# EAGLE design ard-card-adapter (EAGLE 9.3.1)
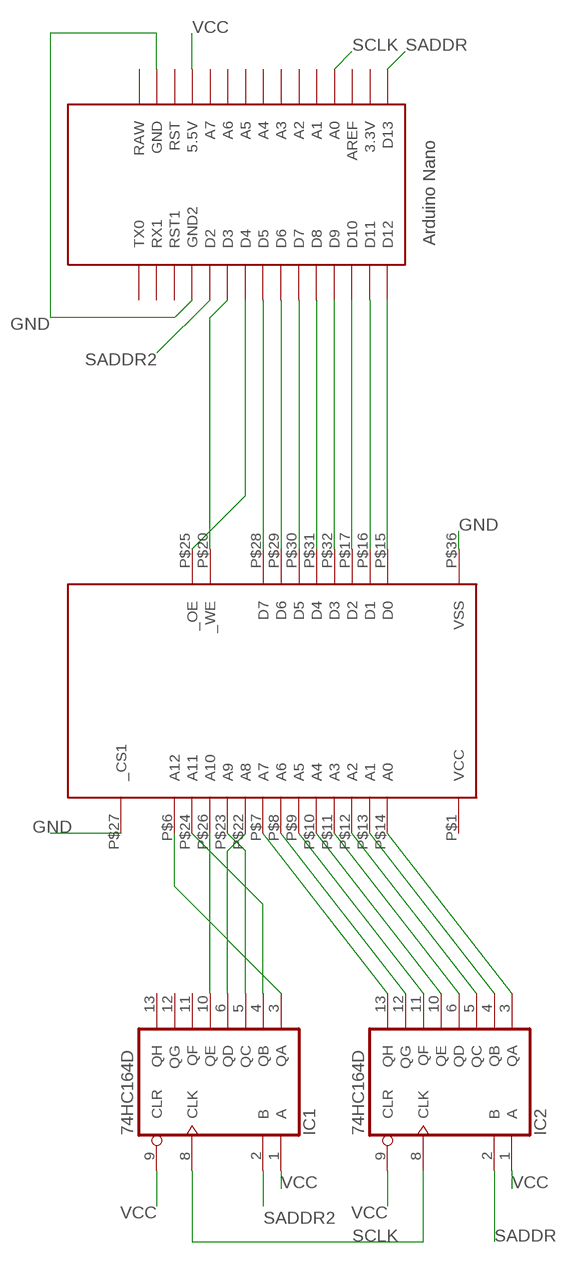
[diagram p0: schematic, sheet 1]

## Parts
IC1  74HC164D  [SO14]
IC2  74HC164D  [SO14]
U$1  NANO  [NANO]
U$2  28C64SLOT  [SLOT36]

## Nets
GND: U$1.GND U$1.GND1(GND2) U$2.P$27(_CS1) U$2.P$36(VSS)
N$1: U$1.D12 U$2.P$15(D0)
N$2: U$1.D11 U$2.P$16(D1)
N$3: U$1.D10 U$2.P$17(D2)
N$4: U$1.D9 U$2.P$32(D3)
N$5: U$1.D8 U$2.P$31(D4)
N$6: U$1.D7 U$2.P$30(D5)
N$7: U$1.D6 U$2.P$29(D6)
N$8: U$1.D5 U$2.P$28(D7)
N$9: U$1.D4 U$2.P$25(_OE)
N$10: U$1.D3 U$2.P$20(_WE)
N$11: IC2.13(QH) U$2.P$7(A7)
N$12: IC2.3(QA) U$2.P$14(A0)
N$13: IC2.4(QB) U$2.P$13(A1)
N$14: IC2.5(QC) U$2.P$12(A2)
N$15: IC2.6(QD) U$2.P$11(A3)
N$16: IC2.10(QE) U$2.P$10(A4)
N$17: IC2.11(QF) U$2.P$9(A5)
N$18: IC2.12(QG) U$2.P$8(A6)
N$19: IC1.3(QA) U$2.P$6(A12)
N$20: IC1.4(QB) U$2.P$24(A11)
N$21: IC1.5(QC) U$2.P$23(A9)
N$22: IC1.6(QD) U$2.P$22(A8)
N$23: IC1.10(QE) U$2.P$26(A10)
SADDR: IC2.2(B) U$1.D13
SADDR2: IC1.2(B) U$1.D2
SCLK: IC1.8(CLK) IC2.8(CLK) U$1.A0
VCC: IC1.1(A) IC1.9(CLR) IC2.1(A) IC2.9(CLR) U$1.5V(5.5V)
Unconnected: IC1.11(QF) IC1.12(QG) IC1.13(QH) U$1.3.3V U$1.A1 U$1.A2 U$1.A3 U$1.A4 U$1.A5 U$1.A6 U$1.A7 U$1.AREF U$1.ICSP1 U$1.ICSP2 U$1.ICSP3 U$1.ICSP4 U$1.ICSP5 U$1.ICSP6 U$1.RAW U$1.RST U$1.RST1 U$1.RX1 U$1.TX0

## Power pins joined to a net without a drawn wire
GND: IC1.7(GND) IC2.7(GND)
VCC: IC1.14(VCC) IC2.14(VCC) U$2.P$1(VCC)

## Library data of the parts
IC1 IC2 = 74xx-us:74*164: 8-bit parallel out SHIFT REGISTER
U$1 = Arduino-clone:NANO: Arduino Nano
U$2 = mychips:28C64

## Board
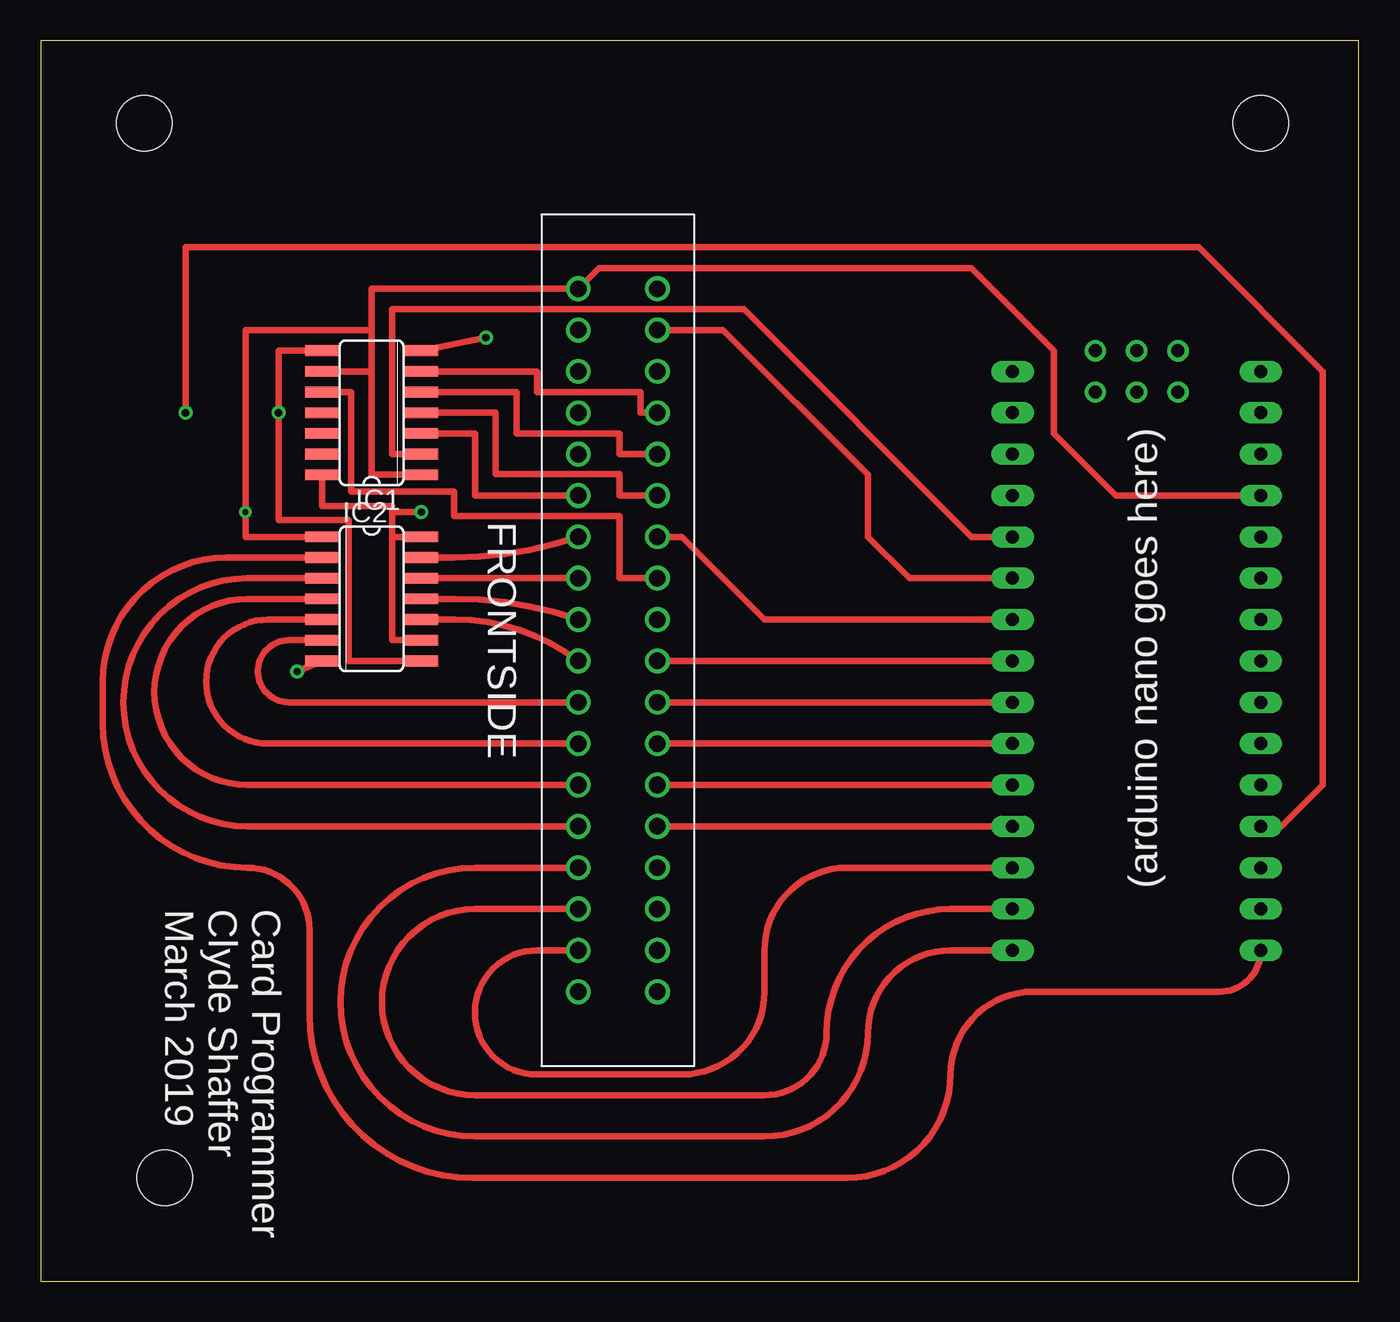
[diagram p1: board, top side]
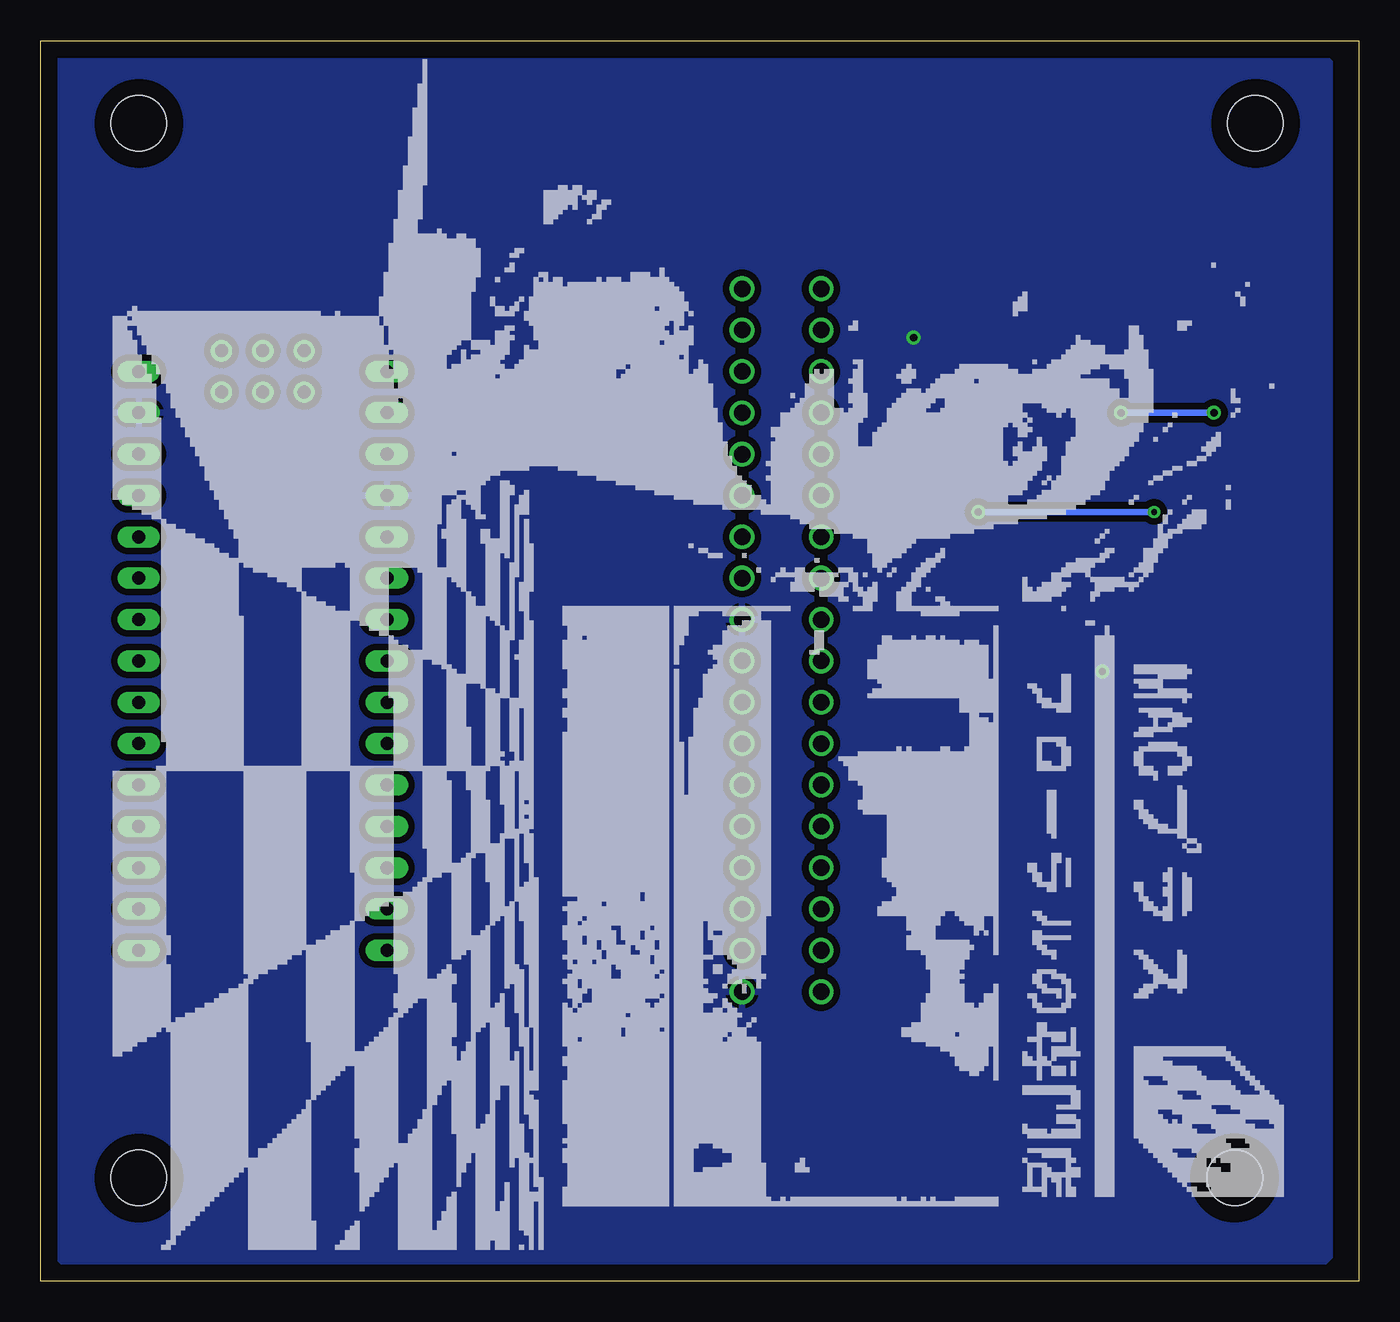
[diagram p2: board, bottom side, seen from below]

Size 80.95 x 76.19 mm. Coordinates in mm from the lower left corner, seen from the top.
Outline: 0,0 80.95,0 80.95,76.19 0,76.19 0,0
Copper layers (1*16): Top 0.035mm / dielectric 1.5mm / Bottom 0.035mm
Design rules "default": minimum track width 6mil, minimum drill 0.35mm, track to track 6mil, track to pad 6mil, pad to pad 6mil, via to via 6mil, smd to smd 6mil, copper to edge 40mil, drill to drill 6mil, minimum pad ring 10mil, minimum via ring 8mil, stop-mask expansion 4mil, vias tented up to drill 0mil, thermal gap 10mil
Holes 3.4 mm at 6.35,71.12 74.93,71.12 74.93,6.35 7.62,6.35

### Footprints (pad centres in the part's own frame; a part is rotated, then mirrored left to right if it is on the bottom)
SO14 = smd 0.66 x 2.032: 1 -3.81,-3.073; 2 -2.54,-3.073; 3 -1.27,-3.073; 4 0,-3.073; 5 1.27,-3.073; 6 2.54,-3.073; 7 3.81,-3.073; 8 3.81,3.073; 9 2.54,3.073; 10 1.27,3.073; 11 0,3.073; 12 -1.27,3.073; 13 -2.54,3.073; 14 -3.81,3.073
NANO = drill 0.8 long: 3.3V -10.16,24.13; 5V -10.16,-1.27; A0 -10.16,19.05; A1 -10.16,16.51; A2 -10.16,13.97; A3 -10.16,11.43; A4 -10.16,8.89; A5 -10.16,6.35; A6 -10.16,3.81; A7 -10.16,1.27; AREF -10.16,21.59; D2 5.08,1.27; D3 5.08,3.81; D4 5.08,6.35; D5 5.08,8.89; D6 5.08,11.43; D7 5.08,13.97; D8 5.08,16.51; D9 5.08,19.05; D10 5.08,21.59; D11 5.08,24.13; D12 5.08,26.67; D13 -10.16,26.67; GND -10.16,-6.35; GND1 5.08,-1.27; RAW -10.16,-8.89; RST -10.16,-3.81; RST1 5.08,-3.81; RX1 5.08,-6.35; TX0 5.08,-8.89 | drill 0.8: ICSP1 -5.08,-10.16; ICSP2 -5.08,-7.62; ICSP3 -2.54,-10.16; ICSP4 -2.54,-7.62; ICSP5 0,-10.16; ICSP6 0,-7.62
SLOT36 = drill 1.016 pad 1.524: P$1 -21.59,0; P$2 -19.05,0; P$3 -16.51,0; P$4 -13.97,0; P$5 -11.43,0; P$6 -8.89,0; P$7 -6.35,0; P$8 -3.81,0; P$9 -1.27,0; P$10 1.27,0; P$11 3.81,0; P$12 6.35,0; P$13 8.89,0; P$14 11.43,0; P$15 13.97,0; P$16 16.51,0; P$17 19.05,0; P$18 21.59,0; P$19 -21.59,4.851; P$20 -19.05,4.851; P$21 -16.51,4.851; P$22 -13.97,4.851; P$23 -11.43,4.851; P$24 -8.89,4.851; P$25 -6.35,4.851; P$26 -3.81,4.851; P$27 -1.27,4.851; P$28 1.27,4.851; P$29 3.81,4.851; P$30 6.35,4.851; P$31 8.89,4.851; P$32 11.43,4.851; P$33 13.97,4.851; P$34 16.51,4.851; P$35 19.05,4.851; P$36 21.59,4.851

### Placement (x,y rotation side)
IC1  20.32,53.34 90 top
IC2  20.32,41.91 270 top
U$1  64.77,46.99 180 top
U$2  33.02,39.37 270 top

### Tracks (layer width: path | path; a pad name or v marks a point on that pad's centre or on a via)
GND  (via drill 0.45)
  Top 0.406: IC1.7 v27.34,57.95 | IC2.7 v15.75,37.45
  pour Bottom (isolate 0.406): 1.78,74 1.78,1.51 2.1,1.19 79.62,1.19 79.94,1.51 79.94,71.62 79.94,74.87 79.62,75.19 2.97,75.19 2.1,75.19 1.78,74.87
N$1
  Top 0.406: U$2.P$15 26.67,25.4 arc180 26.67,8.89 44.45,8.89 arc90 50.8,15.24 arc-90 55.88,20.32 U$1.D12
N$2
  Top 0.406: U$2.P$16 26.67,22.86 arc180 26.67,11.43 44.45,11.43 arc90 48.26,15.24 arc-90 55.88,22.86 U$1.D11
N$3
  Top 0.406: U$2.P$17 30.48,20.32 arc180 30.48,12.7 39.37,12.7 arc90 44.45,17.78 44.45,20.32 arc-90 49.53,25.4 U$1.D10
N$4
  Top 0.406: U$2.P$32 U$1.D9
N$5
  Top 0.406: U$2.P$31 U$1.D8
N$6
  Top 0.406: U$2.P$30 U$1.D7
N$7
  Top 0.406: U$2.P$29 U$1.D6
N$8
  Top 0.406: U$2.P$28 U$1.D5
N$9
  Top 0.406: U$2.P$25 39.37,45.72 44.45,40.64 U$1.D4
N$10
  Top 0.406: U$2.P$20 41.91,58.42 50.8,49.53 50.8,45.72 53.34,43.18 U$1.D3
N$11
  Top 0.406: IC2.13 25.4,44.45 arc19 U$2.P$7
N$12
  Top 0.406: IC2.3 12.7,43.18 arc180 12.7,27.94 U$2.P$14
N$13
  Top 0.406: IC2.4 12.7,41.91 arc180 12.7,30.48 U$2.P$13
N$14
  Top 0.406: IC2.5 13.97,40.64 arc180 13.97,33.02 U$2.P$12
N$15
  Top 0.406: IC2.6 15.24,39.37 arc180 15.24,35.56 U$2.P$11
N$16
  Top 0.406: IC2.10 25.4,40.64 arc-37 U$2.P$10
N$17
  Top 0.406: IC2.11 25.4,41.91 arc-19 U$2.P$9
N$18
  Top 0.406: IC2.12 U$2.P$8
N$19
  Top 0.406: IC1.3 26.67,52.07 26.67,48.26 U$2.P$6
N$20
  Top 0.406: U$2.P$24 35.56,48.26 35.56,49.58 27.94,49.58 27.94,53.34 IC1.4
N$21
  Top 0.406: IC1.5 29.21,54.61 29.21,52.07 35.56,52.07 35.56,50.8 U$2.P$23
N$22
  Top 0.406: IC1.6 30.48,55.88 30.48,54.61 36.83,54.61 36.83,53.34 U$2.P$22
N$23
  Top 0.406: IC1.10 19.05,54.61 19.05,48.51 25.4,48.51 25.4,46.99 35.56,46.99 35.56,43.18 U$2.P$26
SADDR
  Top 0.406: IC2.2 11.43,44.45 arc90 3.81,36.83 3.81,34.29 arc90 12.7,25.4 arc-90 16.51,21.59 16.51,16.35 arc90 26.51,6.35 49.53,6.35 arc90 55.88,12.7 arc-90 60.96,17.78 72.39,17.78 arc90 U$1.D13
SADDR2
  Top 0.406: IC1.2 21.59,50.8 21.59,59.69 43.18,59.69 57.15,45.72 U$1.D2
SCLK  (via drill 0.45)
  Top 0.406: IC2.8 18.92,38.1 18.92,46.74 14.61,46.74 v14.61,53.34 14.61,57.15 IC1.8 | v8.89,53.34 8.89,63.5 71.12,63.5 78.74,55.88 78.74,30.48 76.2,27.94 U$1.A0
  Bottom 0.406: v14.61,53.34 v8.89,53.34
VCC  (via drill 0.35, 0.45)
  Top 0.406: IC2.9 21.59,39.37 21.59,45.72 | 21.59,45.72 IC2.14 | IC1.1 20.32,49.53 20.32,55.88 | 20.32,58.42 20.32,55.88 | 21.59,45.72 21.59,47.24 | IC1.14 17.27,49.53 17.27,47.62 21.59,47.62 21.59,47.24 | 21.59,47.24 v23.37,47.24 | 20.32,58.42 12.57,58.42 v12.57,47.24 12.57,45.72 IC2.1 | 20.32,58.42 20.32,60.96 U$2.P$1 34.29,62.23 57.15,62.23 62.23,57.15 62.23,52.07 66.04,48.26 U$1.5V | IC1.9 20.32,55.88
  Bottom 0.406: v12.57,47.24 v23.37,47.24

### Text on the board
tPlace: FRONTSIDE | (arduino nano goes here) | Card Programmer / Clyde Shaffer / March 2019